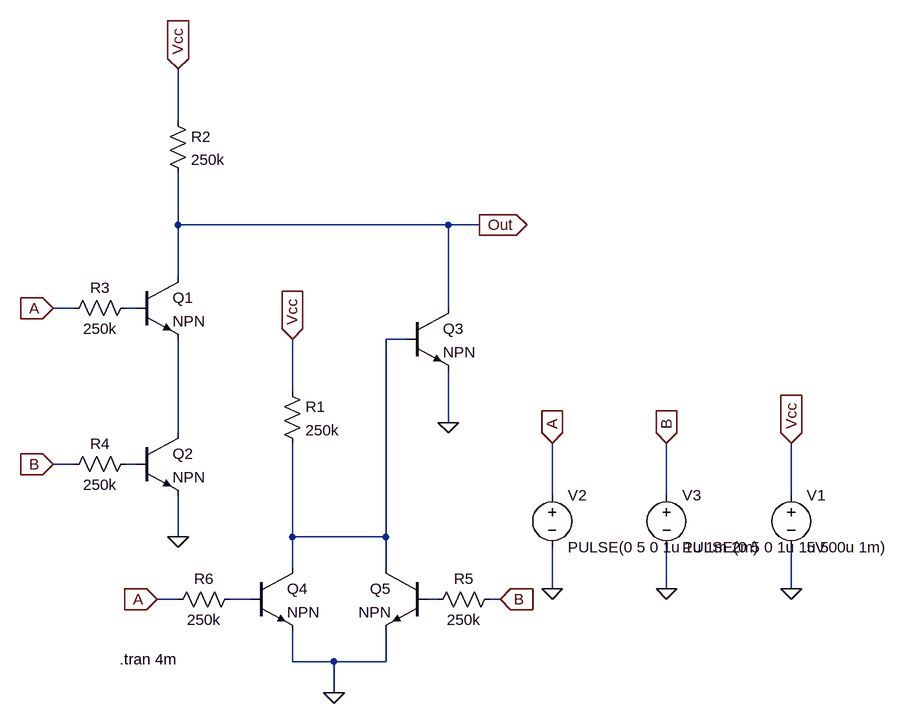
[diagram p0: schematic XOR.asc]
XOR.asc, the LTspice schematic file:
Version 4
SHEET 1 1224 680
WIRE -64 -320 -64 -400
WIRE -64 -160 -64 -240
WIRE 352 -160 -64 -160
WIRE 400 -160 352 -160
WIRE -64 -80 -64 -160
WIRE -224 -32 -256 -32
WIRE -128 -32 -144 -32
WIRE 352 -32 352 -160
WIRE 288 16 256 16
WIRE 112 96 112 16
WIRE 352 144 352 64
WIRE -64 160 -64 16
WIRE -224 208 -256 208
WIRE -128 208 -144 208
WIRE 512 256 512 176
WIRE 688 256 688 176
WIRE 880 256 880 176
WIRE -64 320 -64 256
WIRE 112 320 112 176
WIRE 256 320 256 16
WIRE 256 320 112 320
WIRE 112 368 112 320
WIRE 256 368 256 320
WIRE 512 400 512 336
WIRE 688 400 688 336
WIRE 880 400 880 336
WIRE -64 416 -96 416
WIRE 48 416 16 416
WIRE 336 416 320 416
WIRE 432 416 416 416
WIRE 112 512 112 464
WIRE 176 512 112 512
WIRE 256 512 256 464
WIRE 256 512 176 512
WIRE 176 560 176 512
FLAG 512 400 0
FLAG 688 400 0
FLAG 688 176 B
IOPIN 688 176 In
FLAG 512 176 A
IOPIN 512 176 In
FLAG -64 320 0
FLAG 176 560 0
FLAG 352 144 0
FLAG 112 16 Vcc
IOPIN 112 16 In
FLAG -64 -400 Vcc
IOPIN -64 -400 In
FLAG 400 -160 Out
IOPIN 400 -160 Out
FLAG -256 -32 A
IOPIN -256 -32 In
FLAG -256 208 B
IOPIN -256 208 In
FLAG -96 416 A
IOPIN -96 416 In
FLAG 432 416 B
IOPIN 432 416 In
FLAG 880 400 0
FLAG 880 176 Vcc
IOPIN 880 176 In
SYMBOL voltage 512 240 R0
WINDOW 123 0 0 Left 0
WINDOW 39 0 0 Left 0
SYMATTR InstName V2
SYMATTR Value PULSE(0 5 0 1u 1u 1m 2m)
SYMBOL voltage 688 240 R0
WINDOW 123 0 0 Left 0
WINDOW 39 0 0 Left 0
SYMATTR InstName V3
SYMATTR Value PULSE(0 5 0 1u 1u 500u 1m)
SYMBOL npn -128 -80 R0
SYMATTR InstName Q1
SYMBOL npn -128 160 R0
SYMATTR InstName Q2
SYMBOL npn 288 -32 R0
SYMATTR InstName Q3
SYMBOL npn 48 368 R0
SYMATTR InstName Q4
SYMBOL npn 320 368 M0
SYMATTR InstName Q5
SYMBOL res 96 80 R0
SYMATTR InstName R1
SYMATTR Value 250k
SYMBOL res -80 -336 R0
SYMATTR InstName R2
SYMATTR Value 250k
SYMBOL voltage 880 240 R0
WINDOW 123 0 0 Left 0
WINDOW 39 0 0 Left 0
SYMATTR InstName V1
SYMATTR Value 5V
SYMBOL res -128 -48 R90
WINDOW 0 0 56 VBottom 2
WINDOW 3 32 56 VTop 2
SYMATTR InstName R3
SYMATTR Value 250k
SYMBOL res -128 192 R90
WINDOW 0 0 56 VBottom 2
WINDOW 3 32 56 VTop 2
SYMATTR InstName R4
SYMATTR Value 250k
SYMBOL res 432 400 R90
WINDOW 0 0 56 VBottom 2
WINDOW 3 32 56 VTop 2
SYMATTR InstName R5
SYMATTR Value 250k
SYMBOL res 32 400 R90
WINDOW 0 0 56 VBottom 2
WINDOW 3 32 56 VTop 2
SYMATTR InstName R6
SYMATTR Value 250k
TEXT -154 508 Left 2 !.tran 4m

The netlist it stands for:
* XOR.asc
V2 A 0 PULSE(0 5 0 1u 1u 1m 2m)
V3 B 0 PULSE(0 5 0 1u 1u 500u 1m)
Q1 Out N001 N003 0 NPN
Q2 N003 N004 0 0 NPN
Q3 Out N002 0 0 NPN
Q4 N002 N005 0 0 NPN
Q5 N002 N006 0 0 NPN
R1 Vcc N002 250k
R2 Vcc Out 250k
V1 Vcc 0 5V
R3 N001 A 250k
R4 N004 B 250k
R5 B N006 250k
R6 N005 A 250k
.model NPN NPN
.model PNP PNP
.lib standard.bjt
.tran 4m
.backanno
.end